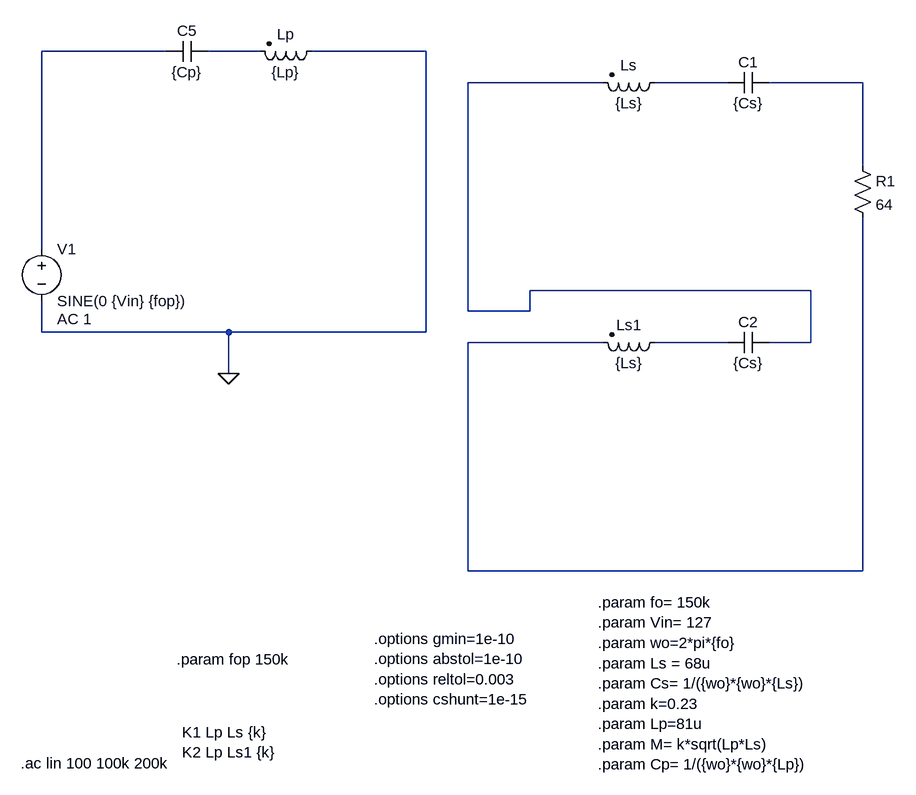
[diagram p0: schematic series-compensation_Tx-Rx - Copy.asc]
series-compensation_Tx-Rx - Copy.asc, the LTspice schematic file:
Version 4
SHEET 1 2752 1872
WIRE 32 112 -160 112
WIRE 176 112 96 112
WIRE 432 112 256 112
WIRE 704 160 496 160
WIRE 896 160 784 160
WIRE 1104 160 960 160
WIRE 1104 288 1104 160
WIRE -160 416 -160 112
WIRE 1024 480 592 480
WIRE 496 512 496 160
WIRE 592 512 592 480
WIRE 592 512 496 512
WIRE -160 544 -160 496
WIRE 128 544 -160 544
WIRE 432 544 432 112
WIRE 432 544 128 544
WIRE 704 560 496 560
WIRE 896 560 784 560
WIRE 1024 560 1024 480
WIRE 1024 560 960 560
WIRE 128 608 128 544
WIRE 496 912 496 560
WIRE 1104 912 1104 368
WIRE 1104 912 496 912
FLAG 128 608 0
SYMBOL voltage -160 400 R0
WINDOW 123 24 124 Left 2
WINDOW 39 0 0 Left 0
SYMATTR Value2 AC 1
SYMATTR InstName V1
SYMATTR Value SINE(0 {Vin} {fop})
SYMBOL ind2 800 144 R90
WINDOW 0 5 56 VBottom 2
WINDOW 3 32 56 VTop 2
SYMATTR InstName Ls
SYMATTR Value {Ls}
SYMATTR Type ind
SYMBOL cap 896 176 R270
WINDOW 0 32 32 VTop 2
WINDOW 3 0 32 VBottom 2
SYMATTR InstName C1
SYMATTR Value {Cs}
SYMBOL ind2 272 96 R90
WINDOW 0 5 56 VBottom 2
WINDOW 3 32 56 VTop 2
SYMATTR InstName Lp
SYMATTR Value {Lp}
SYMATTR Type ind
SYMBOL cap 96 96 R90
WINDOW 0 0 32 VBottom 2
WINDOW 3 32 32 VTop 2
SYMATTR InstName C5
SYMATTR Value {Cp}
SYMBOL res 1088 272 R0
SYMATTR InstName R1
SYMATTR Value 64
SYMBOL ind2 800 544 R90
WINDOW 0 5 56 VBottom 2
WINDOW 3 32 56 VTop 2
SYMATTR InstName Ls1
SYMATTR Value {Ls}
SYMATTR Type ind
SYMBOL cap 896 576 R270
WINDOW 0 32 32 VTop 2
WINDOW 3 0 32 VBottom 2
SYMATTR InstName C2
SYMATTR Value {Cs}
TEXT 48 1048 Left 2 !.param fop 150k
TEXT 696 960 Left 2 !.param fo= 150k\n.param Vin= 127\n.param wo=2*pi*{fo}\n.param Ls = 68u\n.param Cs= 1/({wo}*{wo}*{Ls})\n.param k=0.23\n.param Lp=81u\n.param M= k*sqrt(Lp*Ls)\n.param Cp= 1/({wo}*{wo}*{Lp})
TEXT 352 1016 Left 2 !.options gmin=1e-10\n.options abstol=1e-10\n.options reltol=0.003\n.options cshunt=1e-15
TEXT 56 1160 Left 2 !K1 Lp Ls {k}\nK2 Lp Ls1 {k}
TEXT -192 1208 Left 2 !.ac lin 100 100k 200k

The netlist it stands for:
* series-compensation_Tx-Rx - Copy.asc
V1 N001 0 SINE(0 {Vin} {fop}) AC 1
Ls N004 N003 {Ls}
C1 N004 N005 {Cs}
Lp 0 N002 {Lp}
C5 N002 N001 {Cp}
R1 N005 N006 64
Ls1 N007 N006 {Ls}
C2 N007 N003 {Cs}
.param fop 150k
.param fo= 150k
.param Vin= 127
.param wo=2*pi*{fo}
.param Ls = 68u
.param Cs= 1/({wo}*{wo}*{Ls})
.param k=0.23
.param Lp=81u
.param M= k*sqrt(Lp*Ls)
.param Cp= 1/({wo}*{wo}*{Lp})
.options gmin=1e-10
.options abstol=1e-10
.options reltol=0.003
.options cshunt=1e-15
K1 Lp Ls {k}
K2 Lp Ls1 {k}
.ac lin 100 100k 200k
.backanno
.end